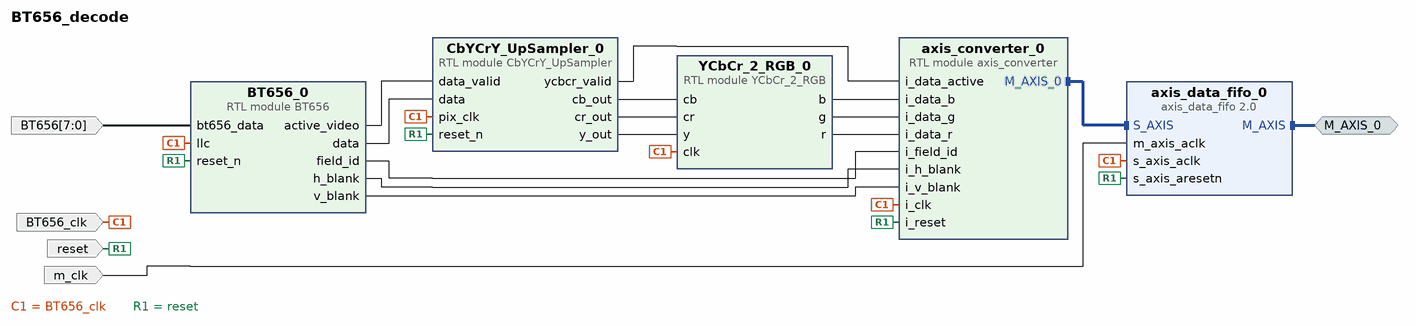
[diagram p0: block diagram of the top level]
# Vivado block design BT656_decode, xc7z020clg400-1, Vivado 2021.2
create_bd_design BT656_decode

create_bd_intf_port -mode Master -vlnv xilinx.com:interface:axis_rtl:1.0 M_AXIS_0
create_bd_port -dir I BT656_clk
create_bd_port -dir I -from 7 -to 0 BT656
create_bd_port -dir I -type rst reset
create_bd_port -dir I -type clk m_clk

create_bd_cell -type ip -vlnv xilinx.com:ip:axis_data_fifo:2.0 axis_data_fifo_0
set_property -dict [list \
  CONFIG.FIFO_DEPTH 8192 \
  CONFIG.HAS_TLAST 1 \
  CONFIG.IS_ACLK_ASYNC 1 \
  CONFIG.TDATA_NUM_BYTES 3 \
  CONFIG.TUSER_WIDTH 1 \
] [get_bd_cells axis_data_fifo_0]
create_bd_cell -type module -reference CbYCrY_UpSampler CbYCrY_UpSampler_0
create_bd_cell -type module -reference BT656 BT656_0
create_bd_cell -type module -reference YCbCr_2_RGB YCbCr_2_RGB_0
create_bd_cell -type module -reference axis_converter axis_converter_0

# ---- connections ----

connect_bd_intf_net [get_bd_intf_pins axis_converter_0/M_AXIS_0] [get_bd_intf_pins axis_data_fifo_0/S_AXIS]
connect_bd_intf_net [get_bd_intf_ports M_AXIS_0] [get_bd_intf_pins axis_data_fifo_0/M_AXIS]
connect_bd_net [get_bd_pins BT656_0/field_id] [get_bd_pins axis_converter_0/i_field_id]
connect_bd_net [get_bd_pins BT656_0/h_blank] [get_bd_pins axis_converter_0/i_h_blank]
connect_bd_net -net BT656_0_o_active_video [get_bd_pins BT656_0/active_video] [get_bd_pins CbYCrY_UpSampler_0/data_valid]
connect_bd_net -net BT656_0_o_data [get_bd_pins BT656_0/data] [get_bd_pins CbYCrY_UpSampler_0/data]
connect_bd_net -net BT656_0_o_data_cb [get_bd_pins CbYCrY_UpSampler_0/cb_out] [get_bd_pins YCbCr_2_RGB_0/cb]
connect_bd_net -net BT656_0_o_data_cr [get_bd_pins CbYCrY_UpSampler_0/cr_out] [get_bd_pins YCbCr_2_RGB_0/cr]
connect_bd_net -net BT656_0_o_data_y [get_bd_pins CbYCrY_UpSampler_0/y_out] [get_bd_pins YCbCr_2_RGB_0/y]
connect_bd_net -net BT656_0_o_ycbcr_valid [get_bd_pins CbYCrY_UpSampler_0/ycbcr_valid] [get_bd_pins axis_converter_0/i_data_active]
connect_bd_net [get_bd_pins BT656_0/v_blank] [get_bd_pins axis_converter_0/i_v_blank]
connect_bd_net -net CAM_LLC_1 [get_bd_ports BT656_clk] \
  [get_bd_pins axis_data_fifo_0/s_axis_aclk] [get_bd_pins CbYCrY_UpSampler_0/pix_clk] [get_bd_pins BT656_0/llc] \
  [get_bd_pins YCbCr_2_RGB_0/clk] [get_bd_pins axis_converter_0/i_clk]
connect_bd_net [get_bd_pins YCbCr_2_RGB_0/b] [get_bd_pins axis_converter_0/i_data_b]
connect_bd_net [get_bd_pins YCbCr_2_RGB_0/g] [get_bd_pins axis_converter_0/i_data_g]
connect_bd_net [get_bd_pins YCbCr_2_RGB_0/r] [get_bd_pins axis_converter_0/i_data_r]
connect_bd_net -net i_data_0_1 [get_bd_ports BT656] [get_bd_pins BT656_0/bt656_data]
connect_bd_net -net m_axis_aclk_0_1 [get_bd_ports m_clk] [get_bd_pins axis_data_fifo_0/m_axis_aclk]
connect_bd_net -net proc_sys_reset_0_peripheral_aresetn [get_bd_ports reset] \
  [get_bd_pins axis_data_fifo_0/s_axis_aresetn] [get_bd_pins CbYCrY_UpSampler_0/reset_n] [get_bd_pins BT656_0/reset_n] \
  [get_bd_pins axis_converter_0/i_reset]

validate_bd_design
save_bd_design
